# EAGLE design neuroskyStm (EAGLE 9.0.0)
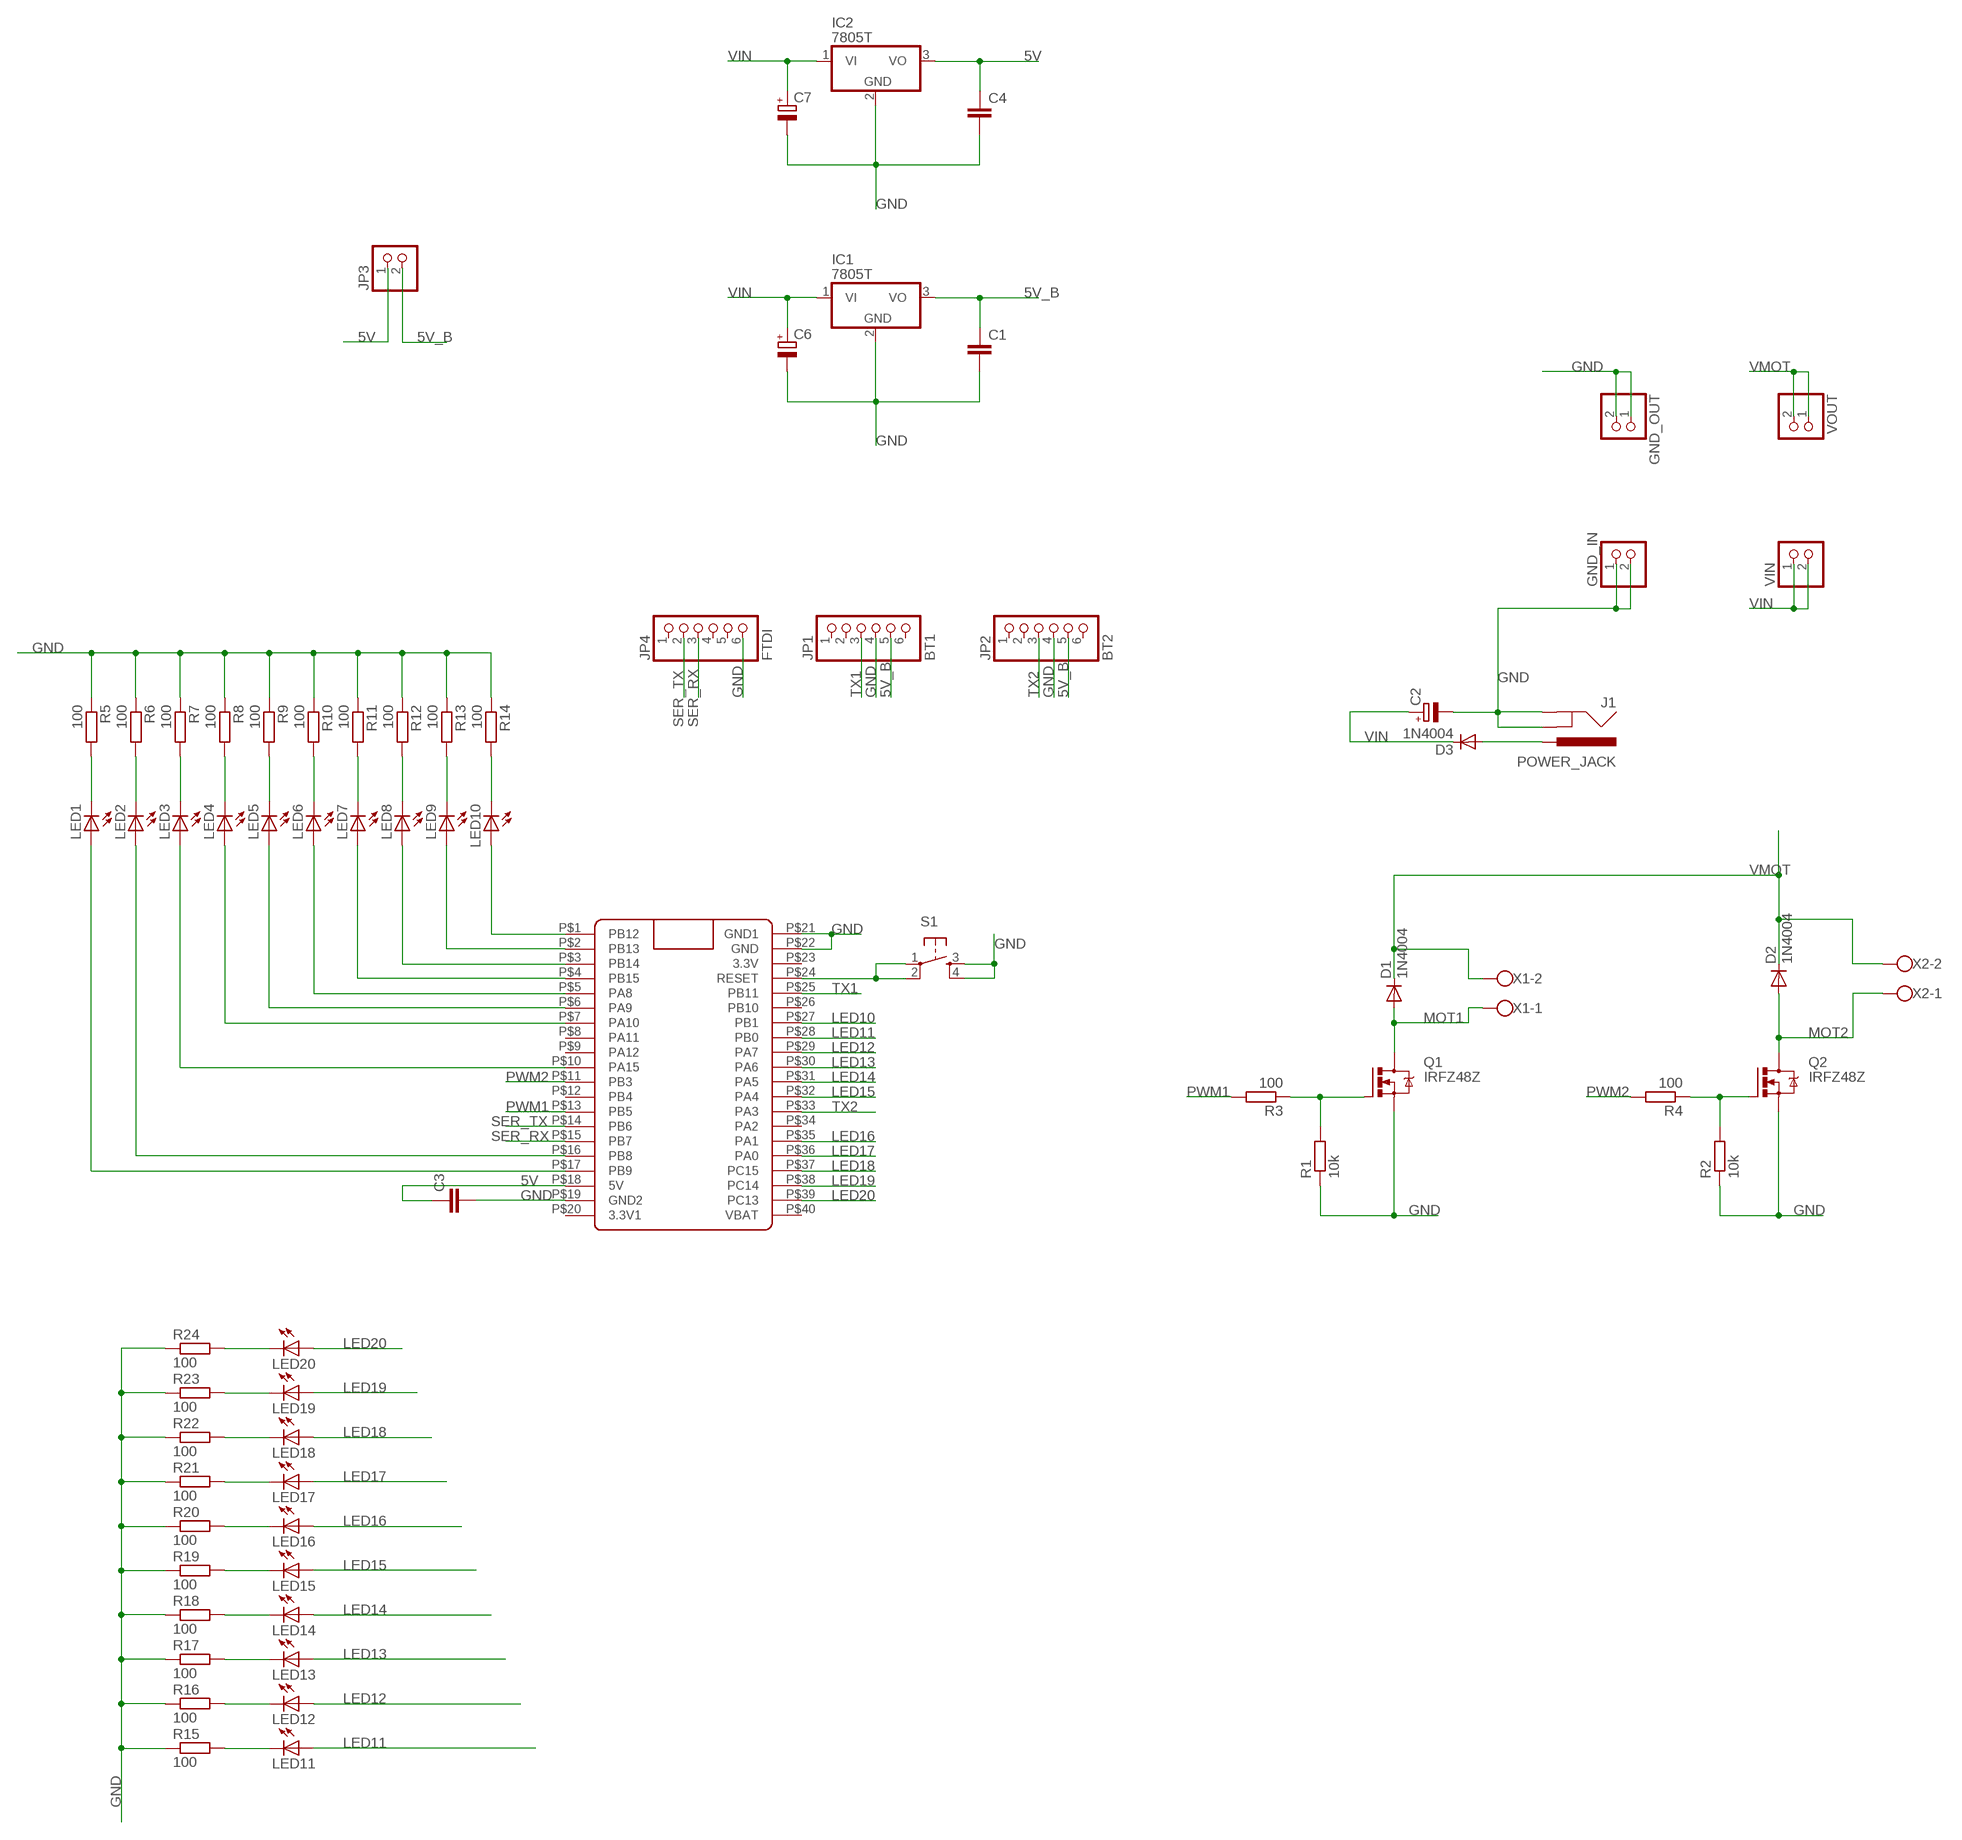
[diagram p0: schematic, sheet 1]

## Parts
C1  C-EU050-035X075  [C050-035X075]
C2  CPOL-EUE3.5-8  [E3,5-8]
C3  C-EU050-035X075  [C050-035X075]
C4  C-EU050-035X075  [C050-035X075]
C6  CPOL-EUE3.5-8  [E3,5-8]
C7  CPOL-EUE3.5-8  [E3,5-8]
D1  1N4004  [DO41-10]
D2  1N4004  [DO41-10]
D3  1N4004  [DO41-10]
GND_IN  PINHD-1X2  [1X02]
GND_OUT  PINHD-1X2  [1X02]
IC1  7805T  [TO220H]
IC2  7805T  [TO220H]
J1  POWER_JACK  [POWER_JACK_PTH]
JP1  BT1  PINHD-1X6  [1X06]
JP2  BT2  PINHD-1X6  [1X06]
JP3  PINHD-1X2  [1X02]
JP4  FTDI  PINHD-1X6  [1X06]
LED1  LED5MM  [LED5MM]
LED2  LED5MM  [LED5MM]
LED3  LED5MM  [LED5MM]
LED4  LED5MM  [LED5MM]
LED5  LED5MM  [LED5MM]
LED6  LED5MM  [LED5MM]
LED7  LED5MM  [LED5MM]
LED8  LED5MM  [LED5MM]
LED9  LED5MM  [LED5MM]
LED10  LED5MM  [LED5MM]
LED11  LED5MM  [LED5MM]
LED12  LED5MM  [LED5MM]
LED13  LED5MM  [LED5MM]
LED14  LED5MM  [LED5MM]
LED15  LED5MM  [LED5MM]
LED16  LED5MM  [LED5MM]
LED17  LED5MM  [LED5MM]
LED18  LED5MM  [LED5MM]
LED19  LED5MM  [LED5MM]
LED20  LED5MM  [LED5MM]
Q1  IRFZ48Z  [TO220BH]
Q2  IRFZ48Z  [TO220BH]
R1  10k  R-EU_0207/10  [0207/10]
R2  10k  R-EU_0207/10  [0207/10]
R3  100  R-EU_0207/10  [0207/10]
R4  100  R-EU_0207/10  [0207/10]
R5  100  R-EU_0207/10  [0207/10]
R6  100  R-EU_0207/10  [0207/10]
R7  100  R-EU_0207/10  [0207/10]
R8  100  R-EU_0207/10  [0207/10]
R9  100  R-EU_0207/10  [0207/10]
R10  100  R-EU_0207/10  [0207/10]
R11  100  R-EU_0207/10  [0207/10]
R12  100  R-EU_0207/10  [0207/10]
R13  100  R-EU_0207/10  [0207/10]
R14  100  R-EU_0207/10  [0207/10]
R15  100  R-EU_0207/10  [0207/10]
R16  100  R-EU_0207/10  [0207/10]
R17  100  R-EU_0207/10  [0207/10]
R18  100  R-EU_0207/10  [0207/10]
R19  100  R-EU_0207/10  [0207/10]
R20  100  R-EU_0207/10  [0207/10]
R21  100  R-EU_0207/10  [0207/10]
R22  100  R-EU_0207/10  [0207/10]
R23  100  R-EU_0207/10  [0207/10]
R24  100  R-EU_0207/10  [0207/10]
S1  TAC_SWITCHPTH  [TACTILE-PTH]
U$1  BLUE_PILL  [BLUE_PILL]
VIN  PINHD-1X2  [1X02]
VOUT  PINHD-1X2  [1X02]
X1  W237-102  [W237-102]
X2  W237-102  [W237-102]

## Nets
5V: C3.1 C4.1 IC2.3(VO) JP3.1 U$1.P$18(5V)
5V_B: C1.1 IC1.3(VO) JP1.5 JP2.5 JP3.2
GND: C1.2 C2.- C3.2 C4.2 C6.- C7.- GND_IN.1 GND_IN.2 GND_OUT.1 GND_OUT.2 IC1.2(GND) IC2.2(GND) J1.GND J1.GNDBREAK JP1.4 JP2.4 JP4.6 Q1.S Q2.S R1.1 R2.1 R5.1 R6.1 R7.1 R8.1 R9.1 R10.1 R11.1 R12.1 R13.1 R14.1 R15.1 R16.1 R17.1 R18.1 R19.1 R20.1 R21.1 R22.1 R23.1 R24.1 S1.3 S1.4 U$1.P$19(GND2) U$1.P$21(GND1) U$1.P$22(GND)
LED10: U$1.P$27(PB1)
LED11: LED11.A U$1.P$28(PB0)
LED12: LED12.A U$1.P$29(PA7)
LED13: LED13.A U$1.P$30(PA6)
LED14: LED14.A U$1.P$31(PA5)
LED15: LED15.A U$1.P$32(PA4)
LED16: LED16.A U$1.P$35(PA1)
LED17: LED17.A U$1.P$36(PA0)
LED18: LED18.A U$1.P$37(PC15)
LED19: LED19.A U$1.P$38(PC14)
LED20: LED20.A U$1.P$39(PC13)
MOT1: D1.A Q1.D X1.1
MOT2: D2.A Q2.D X2.1
N$1: D3.A J1.PWR
N$4: LED10.A U$1.P$1(PB12)
N$5: LED9.A U$1.P$2(PB13)
N$6: Q2.G R2.2 R4.1
N$7: LED8.A U$1.P$3(PB14)
N$8: Q1.G R1.2 R3.1
N$9: LED7.A U$1.P$4(PB15)
N$10: LED6.A U$1.P$5(PA8)
N$11: LED5.A U$1.P$6(PA9)
N$12: LED4.A U$1.P$7(PA10)
N$13: LED3.A U$1.P$10(PA15)
N$14: LED2.A U$1.P$16(PB8)
N$15: LED1.A U$1.P$17(PB9)
N$16: LED1.K(C) R5.2
N$17: LED2.K(C) R6.2
N$18: LED3.K(C) R7.2
N$19: LED4.K(C) R8.2
N$20: LED5.K(C) R9.2
N$21: LED6.K(C) R10.2
N$22: LED7.K(C) R11.2
N$23: LED8.K(C) R12.2
N$24: LED9.K(C) R13.2
N$25: LED10.K(C) R14.2
N$28: S1.1 S1.2 U$1.P$24(RESET)
N$36: LED11.K(C) R15.2
N$37: LED12.K(C) R16.2
N$38: LED13.K(C) R17.2
N$39: LED14.K(C) R18.2
N$40: LED15.K(C) R19.2
N$41: LED16.K(C) R20.2
N$42: LED17.K(C) R21.2
N$43: LED18.K(C) R22.2
N$44: LED19.K(C) R23.2
N$45: LED20.K(C) R24.2
PWM1: R3.2 U$1.P$13(PB5)
PWM2: R4.2 U$1.P$11(PB3)
SER_RX: JP4.3 U$1.P$15(PB7)
SER_TX: JP4.2 U$1.P$14(PB6)
TX1: JP1.3 U$1.P$25(PB11)
TX2: JP2.3 U$1.P$33(PA3)
VIN: C2.+ C6.+ C7.+ D3.C IC1.1(VI) IC2.1(VI) VIN.1 VIN.2
VMOT: D1.C D2.C VOUT.1 VOUT.2 X1.2 X2.2
Unconnected: JP1.1 JP1.2 JP1.6 JP2.1 JP2.2 JP2.6 JP4.1 JP4.4 JP4.5 U$1.P$8(PA11) U$1.P$9(PA12) U$1.P$12(PB4) U$1.P$20(3.3V1) U$1.P$23(3.3V) U$1.P$26(PB10) U$1.P$34(PA2) U$1.P$40(VBAT)

## Library data of the parts
C1 C3 C4 = rcl:C-EU: CAPACITOR, European symbol
C2 C6 C7 = rcl:CPOL-EU: POLARIZED CAPACITOR, European symbol; SPICEPREFIX: C
D1-D3 = adafruit:1N4004: DIODE General purpose 1N400x type rectifier (With bigger pads) http://www.ladyada.net/library/pcb/eaglelibrary.html
GND_IN GND_OUT JP3 VIN VOUT = pinhead:PINHD-1X2: PIN HEADER
IC1 IC2 = linear:78*: Positive VOLTAGE REGULATOR Source: http://cache.national.com/ds/LM/LM78L05.pdf http://www.fairchildsemi.com/ds/LM/LM7805.pdf
J1 = SparkFun-Connectors:POWER_JACK: Power Jack Connector This is the standard 5.5mm barrel jack for power. The PTH is the most common, proven, reliable, footprint. The Slot footprint only works if the mill layer is transmitted to the PCB fab house so be warned. Here are the connectors we sell at SparkFun: DC Barrel Power Jack/Connector <https://www.sparkfun.com/products/119> (PRT-00119) DC Barrel Power Jack/Connector (SMD) <https://www.sparkfun.com/products/12748> (PRT-12748) DC Barrel Jack Adapter - Breadboard Compatible <https://www.sparkfun.com/products/10811> (PRT-10811) It is used on this SparkFun product (and many, many others): SparkFun RedBoard - Programmed with Arduino <https://www.sparkfun.com/products/12757> (DEV-12757) Also, if you need a mating power supply or connector, please check these out: Wall Adapter Power Supply - 9VDC 650mA <https://www.sparkfun.com/products/298> (TOL-00298) DC Barrel Jack Adapter - Male <https://www.sparkfun.com/products/10287> (PRT-10287); PROD_ID: CONN-08197
JP1 JP2 JP4 = pinhead:PINHD-1X6: PIN HEADER
LED1-LED20 = led:LED: LED OSRAM: - CHIPLED LG R971, LG N971, LY N971, LG Q971, LY Q971, LO R971, LY R971 LH N974, LH R974 LS Q976, LO Q976, LY Q976 LO Q996 - Hyper CHIPLED LW Q18S LB Q993, LB Q99A, LB R99A - SideLED LS A670, LO A670, LY A670, LG A670, LP A670 LB A673, LV A673, LT A673, LW A673 LH A674 LY A675 LS A676, LA A676, LO A676, LY A676, LW A676 LS A679, LY A679, LG A679 - Hyper Micro SIDELED® LS Y876, LA Y876, LO Y876, LY Y876 LT Y87S - SmartLED LW L88C, LW L88S LB L89C, LB L89S, LG L890 LS L89K, LO L89K, LY L89K LS L896, LA L896, LO L896, LY L896 - TOPLED LS T670, LO T670, LY T670, LG T670, LP T670 LSG T670, LSP T670, LSY T670, LOP T670, LYG T670 LG T671, LOG T671, LSG T671 LB T673, LV T673, LT T673, LW T673 LH T674 LS T676, LA T676, LO T676, LY T676, LB T676, LH T676, LSB T676, LW T676 LB T67C, LV T67C, LT T67C, LS T67K, LO T67K, LY T67K, LW E67C LS E67B, LA E67B, LO E67B, LY E67B, LB E67C, LV E67C, LT E67C LW T67C LS T679, LY T679, LG T679 LS T770, LO T770, LY T770, LG T770, LP T770 LB T773, LV T773, LT T773, LW T773 LH T774 LS E675, LA E675, LY E675, LS T675 LS T776, LA T776, LO T776, LY T776, LB T776 LHGB T686 LT T68C, LB T68C - Hyper Mini TOPLED® LB M676 - Mini TOPLED Santana® LG M470 LS M47K, LO M47K, LY M47K Source: http://www.osram.convergy.de LUXEON: - LUMILED® LXK2-PW12-R00, LXK2-PW12-S00, LXK2-PW14-U00, LXK2-PW14-V00 LXK2-PM12-R00, LXK2-PM12-S00, LXK2-PM14-U00 LXK2-PE12-Q00, LXK2-PE12-R00, LXK2-PE12-S00, LXK2-PE14-T00, LXK2-PE14-U00 LXK2-PB12-K00, LXK2-PB12-L00, LXK2-PB12-M00, LXK2-PB14-N00, LXK2-PB14-P00, LXK2-PB14-Q00 LXK2-PR12-L00, LXK2-PR12-M00, LXK2-PR14-Q00, LXK2-PR14-R00 LXK2-PD12-Q00, LXK2-PD12-R00, LXK2-PD12-S00 LXK2-PH12-R00, LXK2-PH12-S00 LXK2-PL12-P00, LXK2-PL12-Q00, LXK2-PL12-R00 Source: www.luxeon.com KINGBRIGHT: KA-3528ASYC Source: www.kingbright.com
Q1 Q2 = transistor-power:IRFZ48: N Channel HEXFET® Power MOSFET Logic Level Source: http://www.irf.com/product-info/datasheets/data/irfz48z.pdf
R1-R24 = rcl:R-EU_: RESISTOR, European symbol; SPICEPREFIX: R
S1 = SparkFun:TAC_SWITCH: Momentary Switch Button commonly used for reset or general input. Spark Fun Electronics SKU : COM-00097
U$1 = BluePill:BLUE_PILL
X1 X2 = con-wago-500:W237-102: WAGO SCREW CLAMP; MPN: 237-102; OC_FARNELL: unknown; OC_NEWARK: 70K9898

## Net classes
0 default: width 0.762 mm, clearance 0.762 mm
1 VMOT: width 1.016 mm, clearance 0.762 mm
2 MOT1: width 1.016 mm, clearance 0.762 mm
3 MOT2: width 1.016 mm, clearance 0.762 mm

## Board
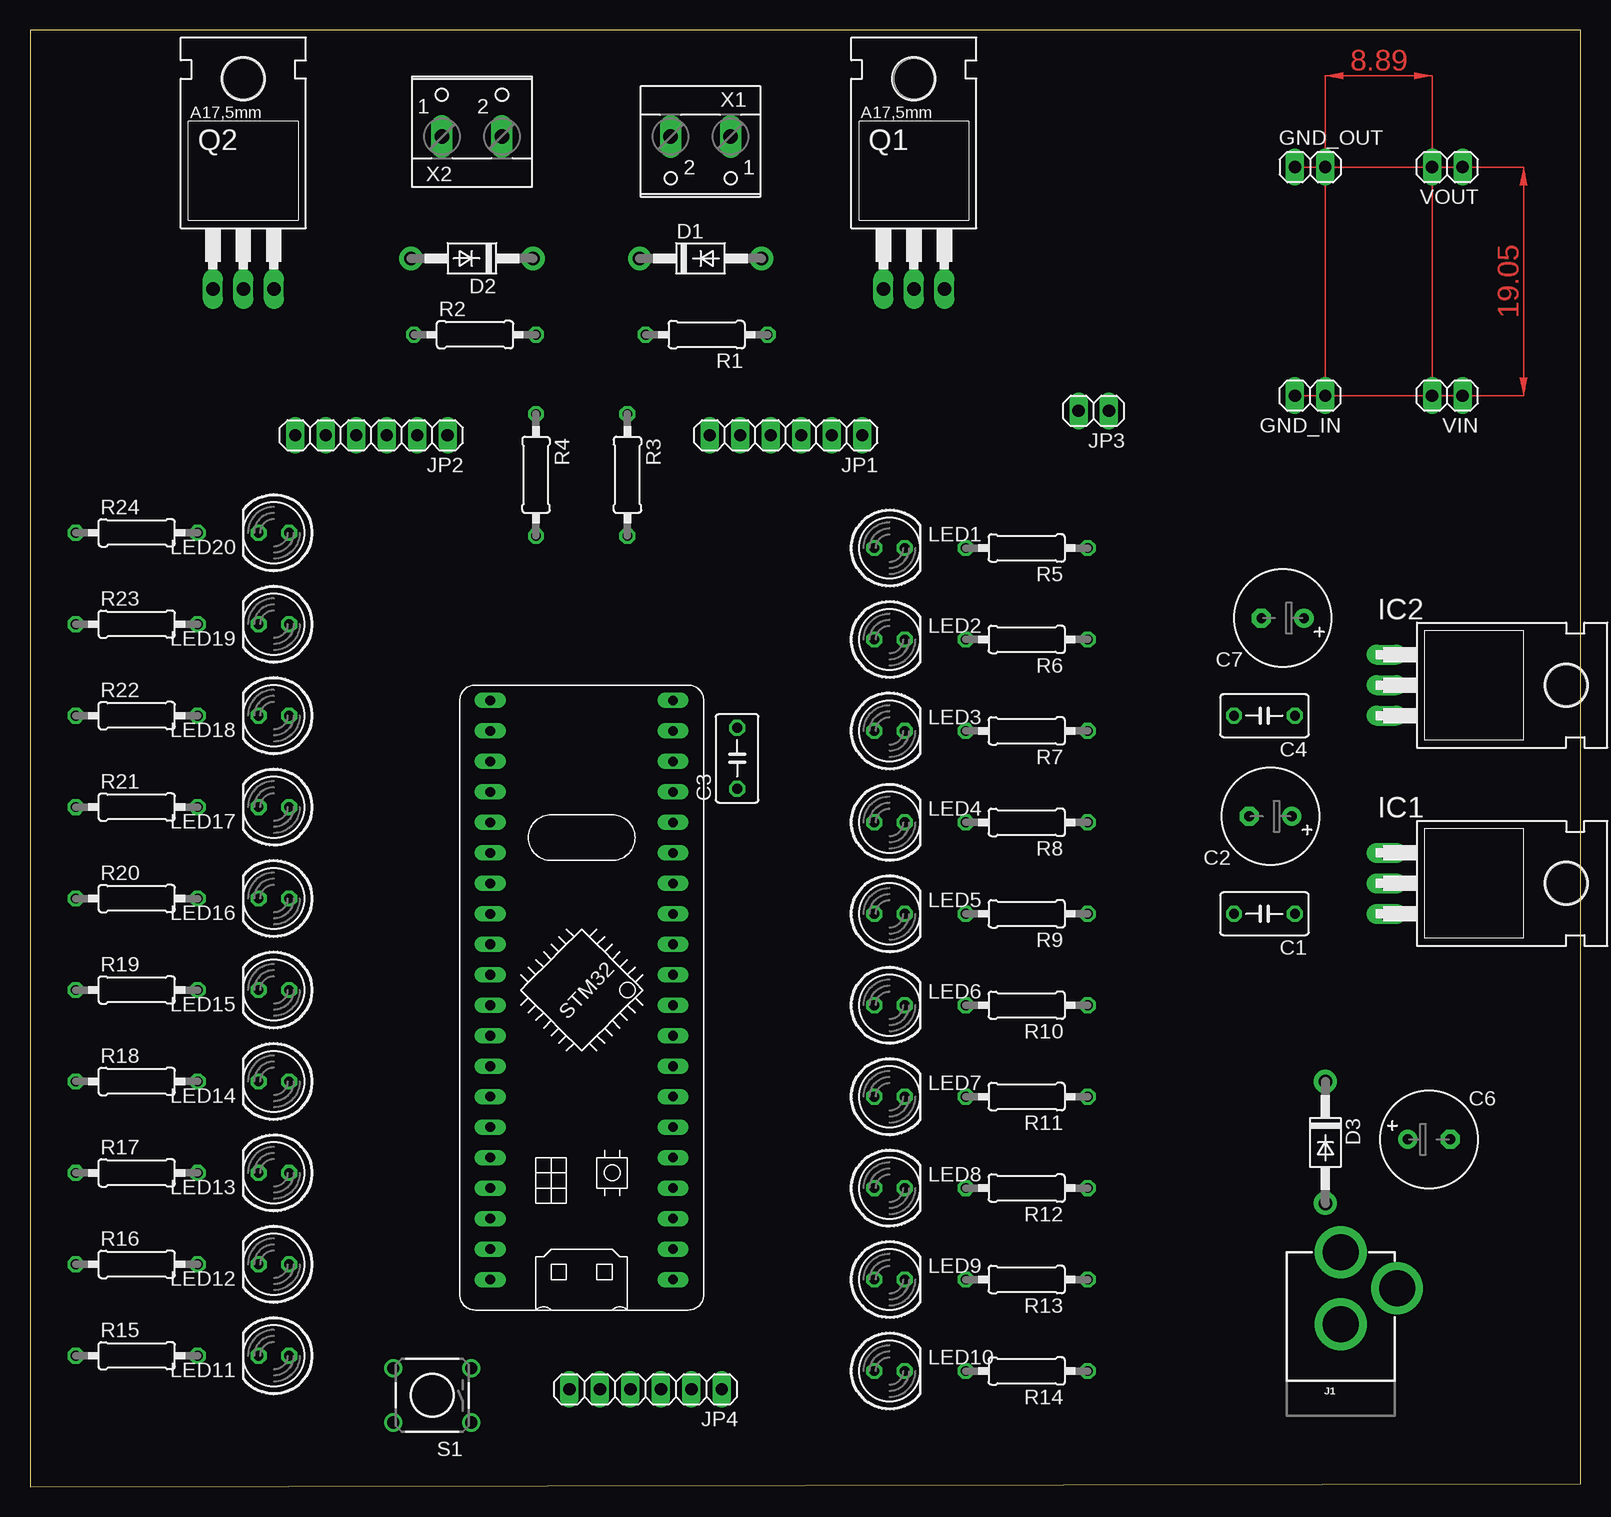
[diagram p1: board, top side]
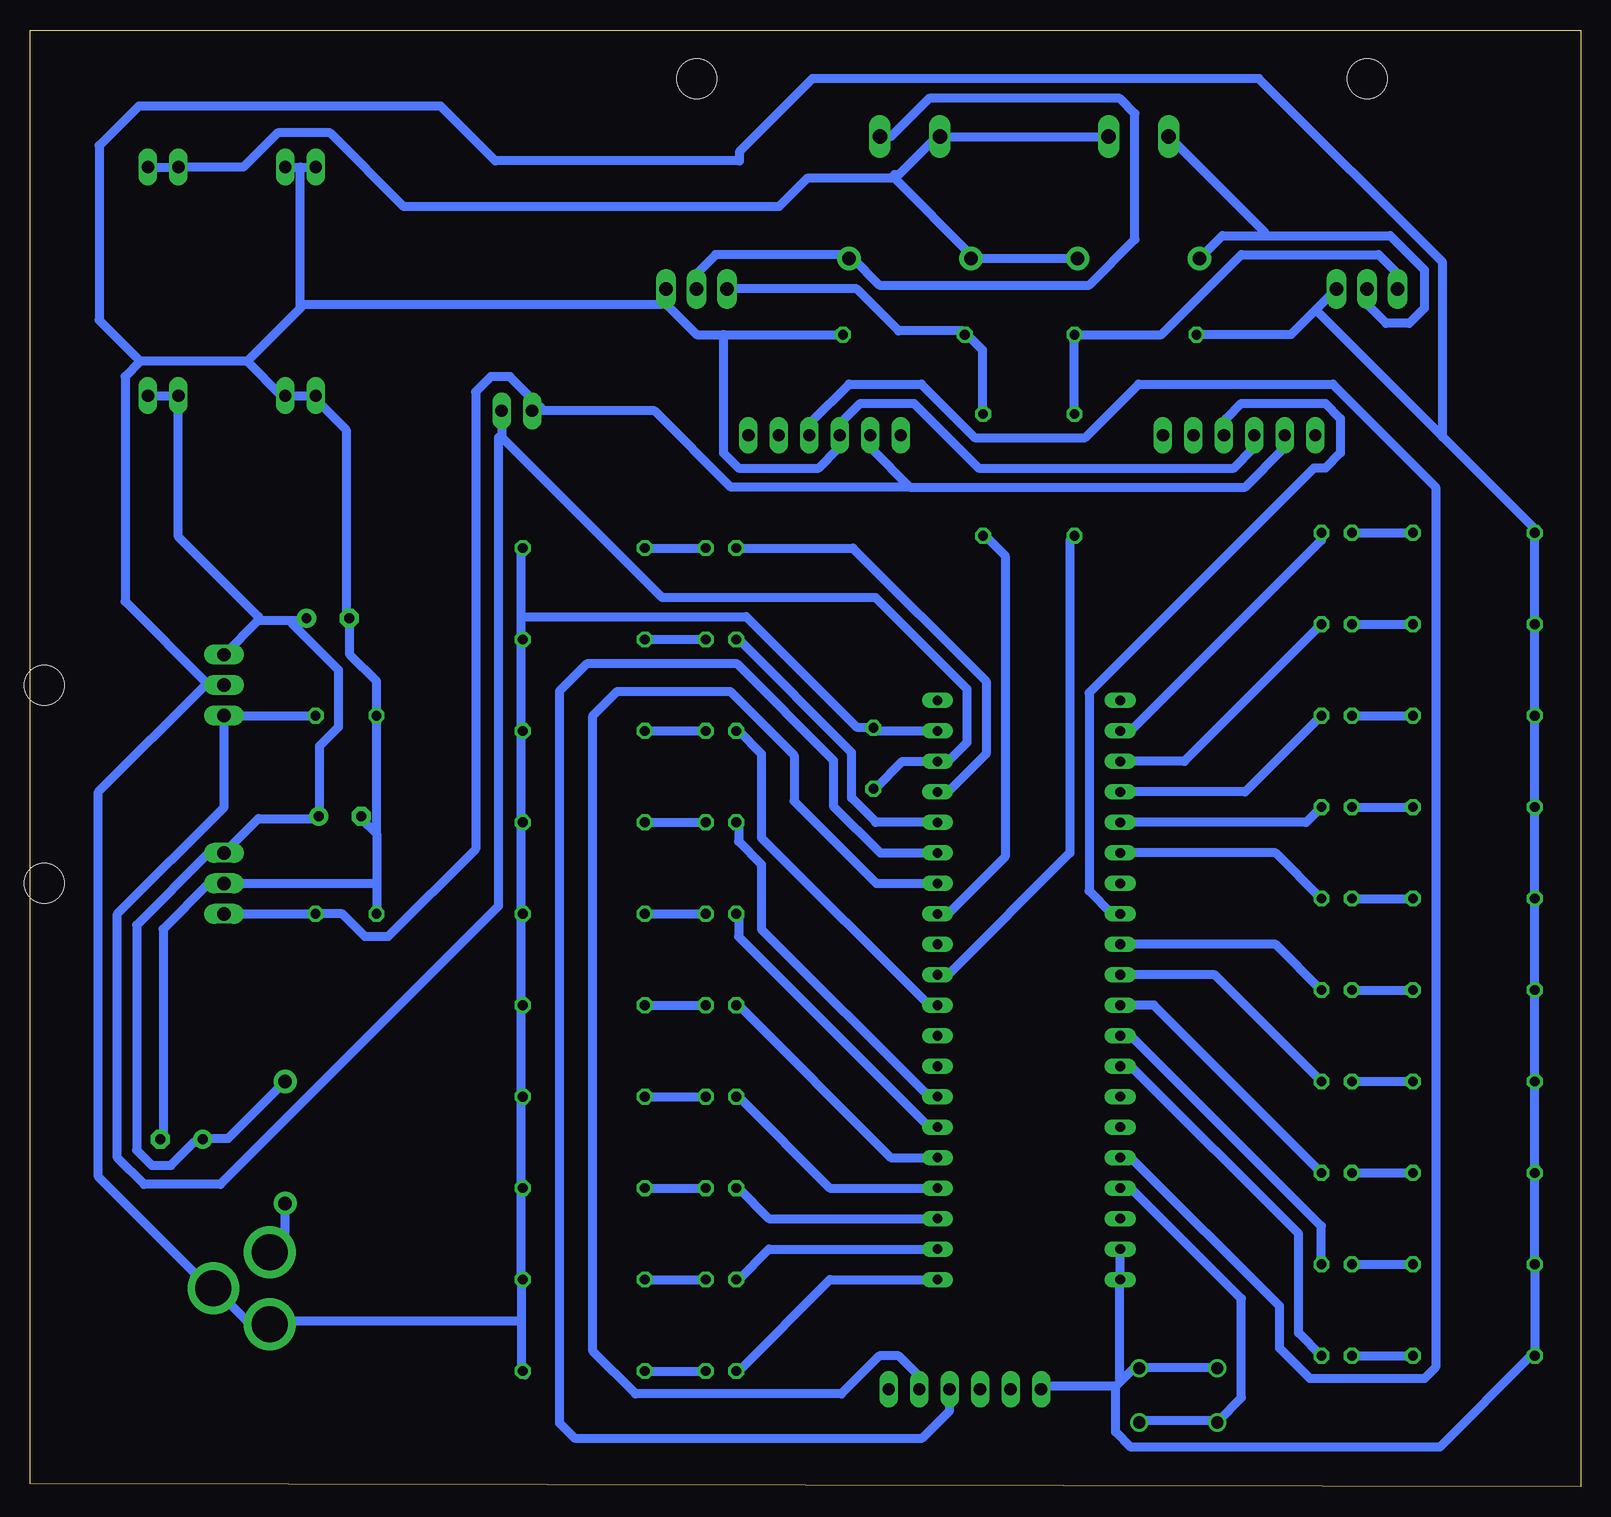
[diagram p2: board, bottom side, seen from below]

Size 129.21 x 121.4 mm. Coordinates in mm from the lower left corner, seen from the top.
Outline: 0,0 129.21,0.25 129.21,121.4 0,121.4 0,0
Copper layers (1*16): Top 0.035mm / dielectric 1.5mm / Bottom 0.035mm
Design rules "default": minimum track width 6mil, minimum drill 0.35mm, track to track 6mil, track to pad 6mil, pad to pad 6mil, via to via 6mil, smd to smd 6mil, copper to edge 40mil, drill to drill 6mil, minimum pad ring 10mil, minimum via ring 8mil, stop-mask expansion 4mil, vias tented up to drill 0mil, thermal gap 10mil

### Footprints (pad centres in the part's own frame; a part is rotated, then mirrored left to right if it is on the bottom)
C050-035X075 = drill 0.813 octagon: 1 -2.54,0; 2 2.54,0
E3,5-8 = drill 0.813 pad 1.6: + -1.778,0 | drill 0.813 pad 1.6 octagon: - 1.778,0
DO41-10 = drill 1.118 pad 1.93: A 5.08,0; C -5.08,0
1X02 = drill 1.016 long: 1 -1.27,0; 2 1.27,0
TO220H = drill 1.118 long: 1 -2.54,-10.16; 2 0,-10.16; 3 2.54,-10.16 | hole 3.302: 0,4.826
POWER_JACK_PTH = drill 2.997 pad 4.318: GND 0,7.7; GNDBREAK 4.7,10.7; PWR 0,13.7
1X06 = drill 1.016 long: 1 -6.35,0; 2 -3.81,0; 3 -1.27,0; 4 1.27,0; 5 3.81,0; 6 6.35,0
LED5MM = drill 0.813 octagon: A -1.27,0; K 1.27,0
TO220BH = drill 1.118 long: D 0,-6.35; G -2.54,-6.35; S 2.54,-6.35 | hole 3.302: 0,11.176
0207/10 = drill 0.813 octagon: 1 -5.08,0; 2 5.08,0
TACTILE-PTH = drill 1.016: 1 -3.251,2.261; 2 3.251,2.261; 3 -3.251,-2.261; 4 3.251,-2.261
BLUE_PILL = drill 0.8 long: P$1 -7.62,15.24; P$2 -7.62,12.7; P$3 -7.62,10.16; P$4 -7.62,7.62; P$5 -7.62,5.08; P$6 -7.62,2.54; P$7 -7.62,0; P$8 -7.62,-2.54; P$9 -7.62,-5.08; P$10 -7.62,-7.62; P$11 -7.62,-10.16; P$12 -7.62,-12.7; P$13 -7.62,-15.24; P$14 -7.62,-17.78; P$15 -7.62,-20.32; P$16 -7.62,-22.86; P$17 -7.62,-25.4; P$18 -7.62,-27.94; P$19 -7.62,-30.48; P$20 -7.62,-33.02; P$21 7.62,15.24; P$22 7.62,12.7; P$23 7.62,10.16; P$24 7.62,7.62; P$25 7.62,5.08; P$26 7.62,2.54; P$27 7.62,0; P$28 7.62,-2.54; P$29 7.62,-5.08; P$30 7.62,-7.62; P$31 7.62,-10.16; P$32 7.62,-12.7; P$33 7.62,-15.24; P$34 7.62,-17.78; P$35 7.62,-20.32; P$36 7.62,-22.86; P$37 7.62,-25.4; P$38 7.62,-27.94; P$39 7.62,-30.48; P$40 7.62,-33.02
W237-102 = drill 1.194 long: 1 -2.5,-1.27; 2 2.5,-1.27

### Placement (x,y rotation side)
C1  102.87,47.75 180 top
C2  103.38,55.88 180 top
C3  58.93,60.71 90 top
C4  102.87,64.26 180 top
C6  116.59,28.96 0 top
C7  104.39,72.39 180 top
D1  55.88,102.36 0 top
D2  36.83,102.36 180 top
D3  107.95,28.7 270 top
GND_IN  106.68,90.93 180 top
GND_OUT  106.68,109.98 0 top
IC1  123.19,50.29 270 top
IC2  123.19,66.8 270 top
J1  109.22,5.84 0 top
JP1  62.99,87.63 180 top
JP2  28.45,87.63 180 top
JP3  88.65,89.66 180 top
JP4  51.31,8.13 180 top
LED1  71.63,78.23 0 top
LED2  71.63,70.61 0 top
LED3  71.63,62.99 0 top
LED4  71.63,55.37 0 top
LED5  71.63,47.75 0 top
LED6  71.63,40.13 0 top
LED7  71.63,32.51 0 top
LED8  71.63,24.89 0 top
LED9  71.63,17.27 0 top
LED10  71.63,9.65 0 top
LED11  20.32,10.92 180 top
LED12  20.32,18.54 180 top
LED13  20.32,26.16 180 top
LED14  20.32,33.78 180 top
LED15  20.32,41.4 180 top
LED16  20.32,49.02 180 top
LED17  20.32,56.64 180 top
LED18  20.32,64.26 180 top
LED19  20.32,71.88 180 top
LED20  20.32,79.5 180 top
Q1  73.66,106.17 0 top
Q2  17.78,106.17 0 top
R1  56.39,96.01 180 top
R2  37.08,96.01 0 top
R3  49.78,84.33 270 top
R4  42.16,84.33 270 top
R5  83.06,78.23 180 top
R6  83.06,70.61 180 top
R7  83.06,62.99 180 top
R8  83.06,55.37 180 top
R9  83.06,47.75 180 top
R10  83.06,40.13 180 top
R11  83.06,32.51 180 top
R12  83.06,24.89 180 top
R13  83.06,17.27 180 top
R14  83.06,9.65 180 top
R15  8.89,10.92 0 top
R16  8.89,18.54 0 top
R17  8.89,26.16 0 top
R18  8.89,33.78 0 top
R19  8.89,41.4 0 top
R20  8.89,49.02 0 top
R21  8.89,56.64 0 top
R22  8.89,64.26 0 top
R23  8.89,71.88 0 top
R24  8.89,79.5 0 top
S1  33.53,7.62 180 top
U$1  45.97,32.51 180 top
VIN  118.11,90.93 180 top
VOUT  118.11,109.98 180 top
X1  55.88,111.25 180 top
X2  36.83,113.79 0 top

### Tracks (layer width: path | path; a pad name or v marks a point on that pad's centre or on a via)
5V
  Bottom 0.762: C4.1 IC2.3 113.03,56.64 121.92,47.75 121.92,27.43 119.7,25.21 113.35,25.21 90.17,48.39 90.17,87.44 89.85,87.44 | C3.1 58.74,58.23 56.52,60.45 U$1.P$18 52.7,60.45 51.12,62.04 51.12,66.48 58.74,74.1 76.52,74.1 89.85,87.44 | 89.85,87.44 89.85,89.66 JP3.1
5V_B
  Bottom 0.762: IC1.3 C1.1 103.19,47.75 101.28,45.85 99.38,45.85 92.08,53.15 92.08,91.25 90.8,92.52 89.22,92.52 86.68,89.98 JP3.2 77.15,89.66 70.8,83.31 55.88,83.31 | 55.88,83.31 27.94,83.31 24.77,86.49 24.77,87.44 JP2.5 | 55.88,83.31 59.05,86.49 59.05,87.44 JP1.5
GND
  Bottom 0.762: 100.33,54.42 100.33,50.29 | 100.33,50.29 C1.2 | 100.33,54.42 101.6,55.69 C2.- | 100.33,54.42 C4.2 100.33,67.12 102.55,69.34 102.55,72.2 C7.- 102.87,72.52 102.87,88.08 105.41,90.61 GND_IN.2 GND_IN.1 108.27,90.93 111.12,93.79 | C6.- 118.11,29.02 118.11,46.48 114.3,50.29 IC1.2 100.33,50.29 | JP2.4 27.3,87.44 27.3,86.49 28.89,84.9 50.16,84.9 55.56,90.3 60.01,90.3 61.59,88.71 61.59,87.76 JP1.4 61.91,87.44 61.91,86.49 63.5,84.9 70.17,84.9 71.44,86.17 71.44,96.01 | 71.44,96.01 73.66,96.01 76.2,98.55 Q1.S 76.52,98.55 106.68,98.55 | 71.44,96.01 R1.1 | GND_OUT.2 106.68,109.98 | 106.68,109.98 GND_OUT.1 | 120.02,93.79 121.29,92.52 121.29,73.79 114.3,66.8 IC2.2 114.62,66.8 123.51,57.91 123.51,25.84 114.3,16.64 J1.GNDBREAK 113.67,16.32 111.12,13.78 109.22,13.78 J1.GND 108.9,13.78 88.27,13.78 | 111.12,93.79 120.02,93.79 | 106.68,98.55 106.68,109.98 | U$1.P$19 58.74,62.99 C3.2 59.05,63.31 60.33,63.31 69.53,72.52 88.27,72.52 | 88.27,13.78 88.27,17.27 R13.1 88.27,17.59 88.27,24.89 R12.1 88.27,25.21 88.27,32.51 R11.1 88.27,32.83 88.27,40.13 R10.1 88.27,40.45 88.27,47.75 R9.1 88.27,48.07 88.27,55.37 R8.1 88.27,55.69 88.27,62.99 R7.1 88.27,63.31 88.27,70.61 R6.1 88.27,70.93 88.27,72.52 | 88.27,13.78 88.27,9.65 R14.1 87.95,9.34 | 88.27,72.52 88.27,78.23 R5.1 | U$1.P$22 38.42,19.81 38.42,17.27 U$1.P$21 38.42,16.95 38.42,9.02 38.26,8.86 | S1.4 30.48,9.97 36.51,9.97 S1.3 37.15,9.97 38.26,8.86 | 38.73,8.38 44.77,8.38 JP4.6 | 38.26,8.86 38.73,8.38 | R2.1 24.13,96.01 22.07,98.08 | Q2.S 22.07,98.08 | 11.49,87.5 22.07,98.08 | 38.73,8.38 38.73,4.57 37.46,3.3 11.75,3.3 4.13,10.92 R15.1 R16.1 R17.1 R18.1 R19.1 R20.1 R21.1 R22.1 R23.1 R24.1 3.81,79.82 11.49,87.5
  Bottom 0.762: 11.49,87.5 11.49,102.04 26.8,117.35 64.01,117.35 70.1,111.25 70.1,110.49 90.42,110.49 95,115.06 120.14,115.06 123.44,111.76 123.44,97.22 120.02,93.79 | 111.12,93.79 106.68,98.23 106.68,98.55
LED11
  Bottom 0.762: U$1.P$28 37.46,35.05 23.49,21.08 23.49,12.83 LED11.A
LED12
  Bottom 0.762: U$1.P$29 37.46,37.59 21.59,21.72 LED12.A
LED13
  Bottom 0.762: U$1.P$30 35.56,40.13 LED13.A
LED14
  Bottom 0.762: U$1.P$31 30.48,42.67 LED14.A
LED15
  Bottom 0.762: U$1.P$32 25.4,45.21 LED15.A
LED16
  Bottom 0.762: U$1.P$35 25.4,52.83 LED16.A
LED17
  Bottom 0.762: U$1.P$36 22.86,55.37 LED17.A
LED18
  Bottom 0.762: U$1.P$37 27.94,57.91 LED18.A
LED19
  Bottom 0.762: U$1.P$38 33.02,60.45 LED19.A
LED20
  Bottom 0.762: U$1.P$39 37.46,62.99 21.59,78.87 LED20.A
MOT1
  Bottom 0.762: Q1.D 73.66,101.09 72.07,102.68 61.28,102.68 D1.A 60.64,102.36 58.42,100.14 40.96,100.14 37.15,103.95 37.15,114.43 38.42,115.7 54.29,115.7 57.47,112.52 X1.1
MOT2
  Bottom 0.762: Q2.D 17.78,98.55 16.19,96.97 14.29,96.97 13.02,98.23 13.02,101.41 15.88,104.27 26.35,104.27 | 26.35,104.27 29.84,104.27 D2.A | X2.1 34.29,112.52 26.35,104.58 26.35,104.27
N$1
  Bottom 0.762: D3.A 107.95,21.08 109.22,19.81 J1.PWR
N$4
  Bottom 0.762: U$1.P$1 62.55,17.27 70.17,9.65 LED10.A
N$5
  Bottom 0.762: U$1.P$2 67.63,19.81 70.17,17.27 LED9.A
N$6
  Bottom 0.762: R4.1 42.23,89.66 42.23,96.01 R2.2 34.92,96.01 28.26,102.68 16.83,102.68 15.24,101.09 Q2.G
N$7
  Bottom 0.762: U$1.P$3 67.63,22.35 70.17,24.89 LED8.A
N$8
  Bottom 0.762: R3.1 49.85,89.66 49.85,94.74 51.12,96.01 R1.2 51.44,96.33 56.83,96.33 60.33,99.82 Q1.G
N$9
  Bottom 0.762: U$1.P$4 62.55,24.89 70.17,32.51 LED7.A
N$10
  Bottom 0.762: U$1.P$5 57.47,27.43 70.17,40.13 LED6.A
N$11
  Bottom 0.762: U$1.P$6 54.29,29.97 70.17,45.85 70.17,47.75 LED5.A
N$12
  Bottom 0.762: U$1.P$7 54.29,32.51 68.26,46.48 68.26,51.88 70.17,53.78 70.17,55.37 LED4.A
N$13
  Bottom 0.762: U$1.P$10 54.29,40.13 68.26,54.1 68.26,61.09 70.17,62.99 LED3.A
N$14
  Bottom 0.762: U$1.P$16 58.74,55.37 58.74,55.42 60.73,57.42 60.73,61.18 70.17,70.61 LED2.A
N$15
  Bottom 0.762: U$1.P$17 52.7,57.91 49.53,61.09 49.53,67.12 60.64,78.23 LED1.A
N$16
  Bottom 0.762: R5.2 LED1.K
N$17
  Bottom 0.762: R6.2 LED2.K
N$18
  Bottom 0.762: R7.2 LED3.K
N$19
  Bottom 0.762: R8.2 LED4.K
N$20
  Bottom 0.762: R9.2 LED5.K
N$21
  Bottom 0.762: R10.2 LED6.K
N$22
  Bottom 0.762: R11.2 LED7.K
N$23
  Bottom 0.762: R12.2 LED8.K
N$24
  Bottom 0.762: R13.2 LED9.K
N$25
  Bottom 0.762: R14.2 LED10.K
N$28
  Bottom 0.762: U$1.P$24 37.46,24.89 28.26,15.69 28.26,7.43 30.16,5.53 S1.2 30.48,5.53 36.51,5.53 S1.1
N$36
  Bottom 0.762: LED11.K R15.2
N$37
  Bottom 0.762: LED12.K R16.2
N$38
  Bottom 0.762: LED13.K R17.2
N$39
  Bottom 0.762: LED14.K R18.2
N$40
  Bottom 0.762: LED15.K R19.2
N$41
  Bottom 0.762: LED16.K R20.2
N$42
  Bottom 0.762: LED17.K R21.2
N$43
  Bottom 0.762: LED18.K R22.2
N$44
  Bottom 0.762: LED19.K R23.2
N$45
  Bottom 0.762: LED20.K R24.2
PWM1
  Bottom 0.762: U$1.P$13 52.7,47.75 47.94,52.52 47.94,77.6 49.53,79.19 R3.2
PWM2
  Bottom 0.762: U$1.P$11 52.7,42.67 42.55,52.83 42.55,78.87 R4.2
SER_RX
  Bottom 0.762: JP4.3 52.58,6.35 54.86,4.06 83.82,4.06 85.09,5.33 85.09,66.29 82.8,68.58 70.29,68.58 62.25,60.55 62.25,56.73 58.35,52.83 U$1.P$15
SER_TX
  Bottom 0.762: JP4.2 55.25,8.38 55.25,9.34 56.83,10.92 58.42,10.92 61.59,7.75 78.74,7.75 82.3,11.3 82.3,64.26 80.26,66.29 70.87,66.29 65.53,60.96 65.53,57.15 58.67,50.29 U$1.P$14
TX1
  Bottom 0.762: U$1.P$25 37.46,27.43 25.08,15.05 25.08,11.56 22.54,9.02 13.02,9.02 12.06,9.97 12.06,83.31 20.64,91.88 36.83,91.88 41.27,87.44 50.48,87.44 54.93,91.88 60.96,91.88 64.14,88.71 64.14,87.76 JP1.3
TX2
  Bottom 0.762: U$1.P$33 39.05,47.75 40.96,49.66 40.96,66.17 22.22,84.9 21.27,84.9 20,86.17 20,89.03 21.27,90.3 28.26,90.3 29.53,89.03 29.53,87.76 JP2.3
VIN
  Bottom 0.762: D3.C 112.71,29.02 114.62,29.02 C6.+ 114.94,28.7 115.57,28.7 117.47,26.8 119.06,26.8 120.33,28.07 120.33,46.8 114.3,52.83 IC1.1 110.17,55.69 105.41,55.69 C2.+ 105.09,56.01 105.09,61.72 103.5,63.31 103.5,68.07 107.31,71.88 107.31,72.2 | VIN.1 VIN.2 116.84,79.19 110.17,72.52 110.17,72.2 | 110.17,72.2 107.31,72.2 | 107.31,72.2 106.36,72.2 C7.+ | IC2.1 110.17,72.2
VMOT
  Bottom 0.762: D2.C D1.C 50.8,102.68 57.15,109.03 | VOUT.1 VOUT.2 111.44,109.98 108.58,112.84 104.2,112.84 98.04,106.68 66.8,106.68 64.45,109.03 57.15,109.03 | X2.2 X1.2 53.66,112.52 56.83,109.35 57.15,109.35 57.15,109.03
(copper drawn outside any net)
  shapes: Top area x2